# EAGLE schematic WaldoRevE (EAGLE 8.5.1)

## Sheet 1 of 4: Microcontroller Module
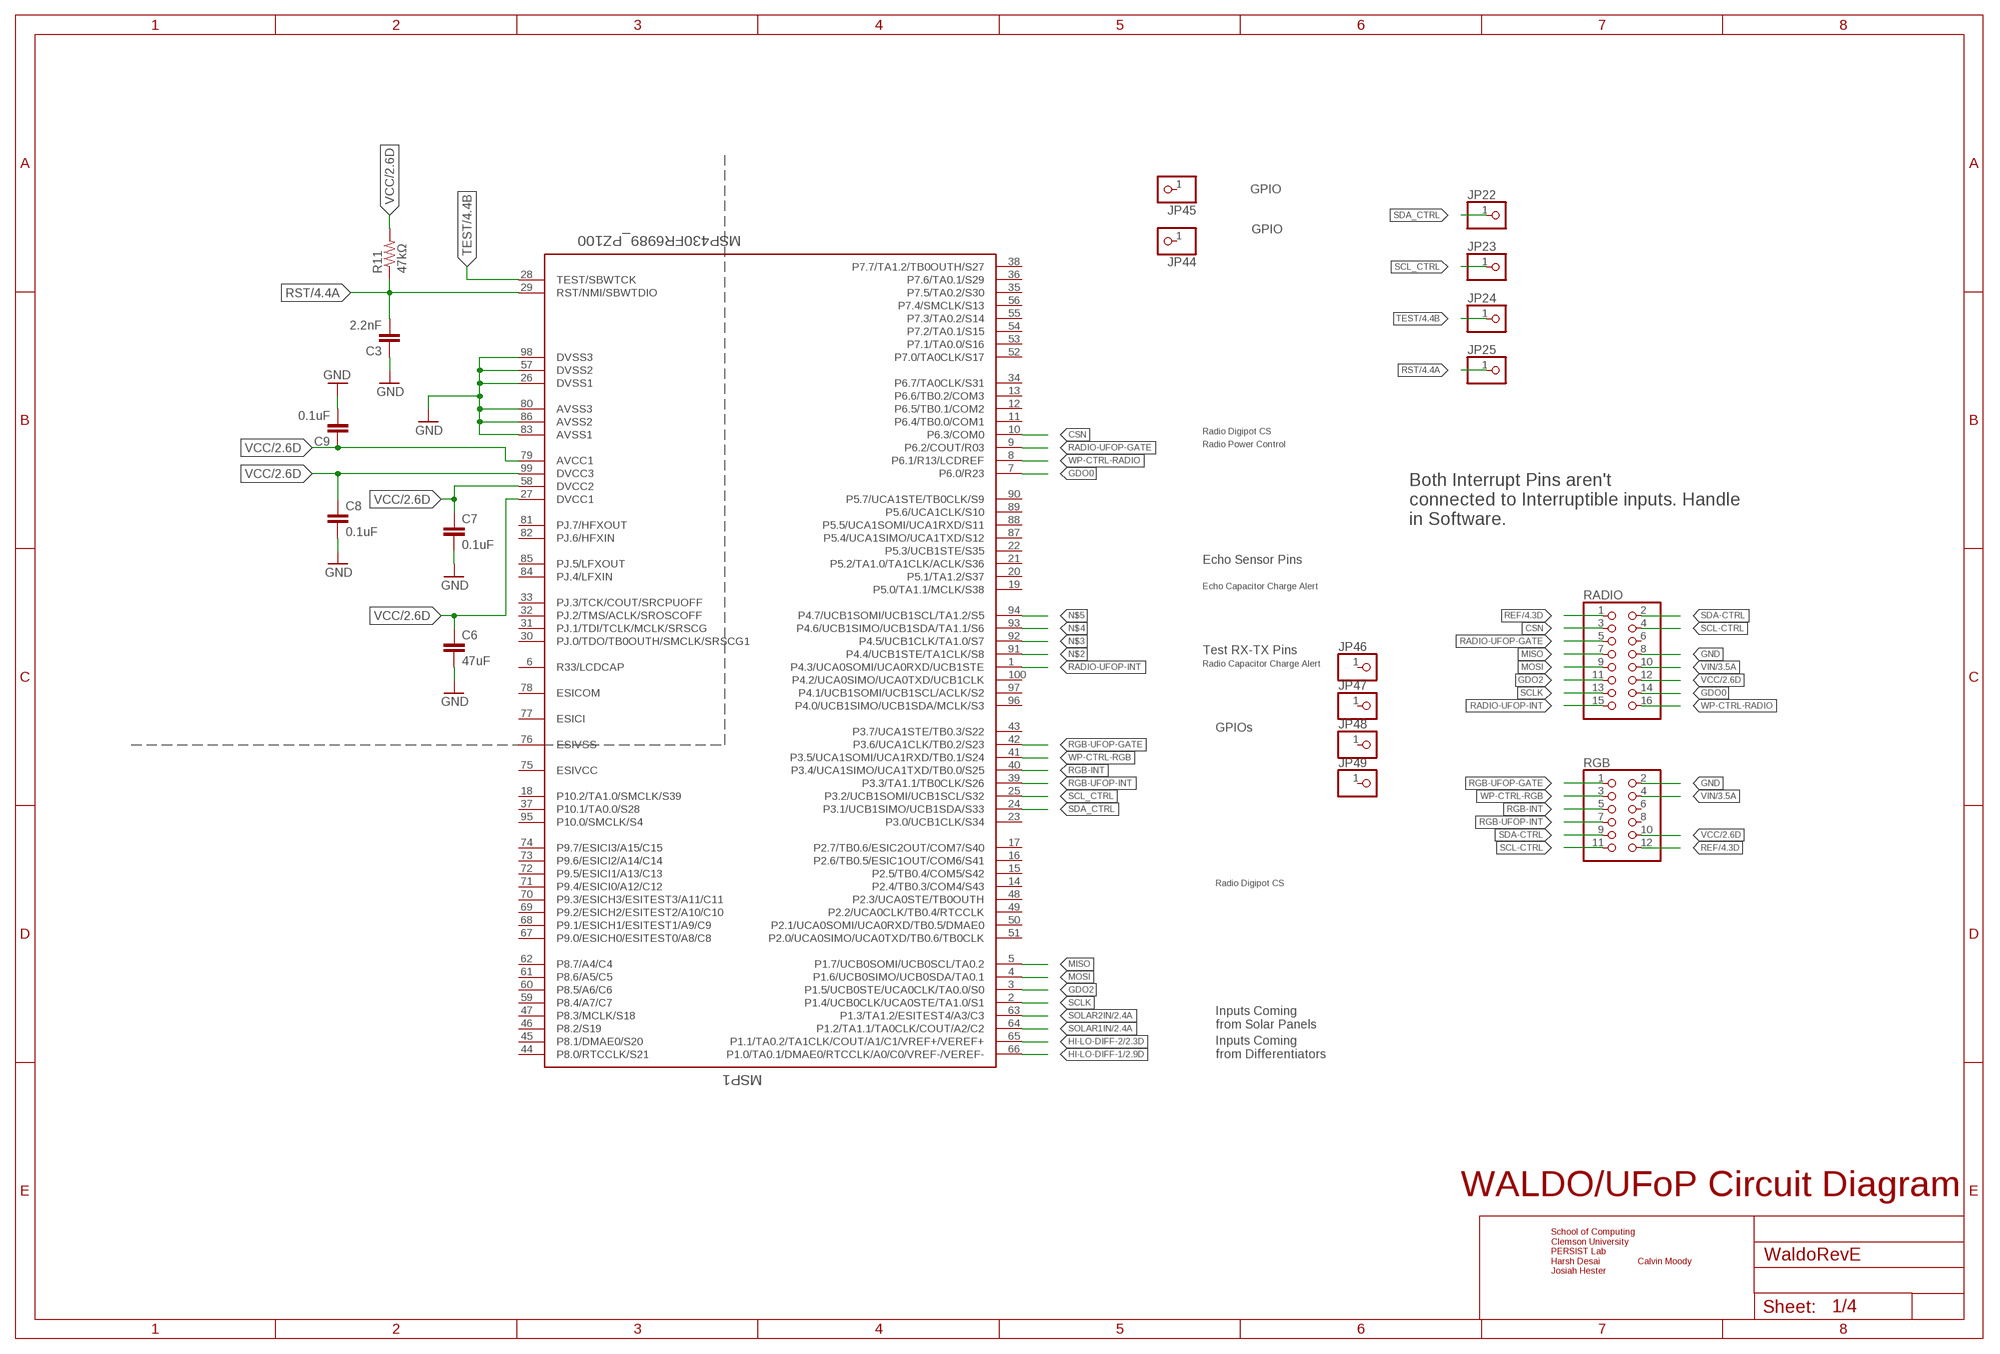
[diagram p0: schematic, sheet 1]

### Parts
C3  2.2nF  CAP0805  [0805]
C6  47uF  CAP0805  [0805]
C7  0.1uF  CAP0805  [0805]
C8  0.1uF  CAP0805  [0805]
C9  0.1uF  CAP0805  [0805]
JP22  PINHD-1X1  [1X01]
JP23  PINHD-1X1  [1X01]
JP24  PINHD-1X1  [1X01]
JP25  PINHD-1X1  [1X01]
JP44  PINHD-1X1  [1X01]
JP45  PINHD-1X1  [1X01]
JP46  PINHD-1X1  [1X01]
JP47  PINHD-1X1  [1X01]
JP48  PINHD-1X1  [1X01]
JP49  PINHD-1X1  [1X01]
MSP1  MSP430FR6989_PZ100  [PZ100]
R11  47kΩ  RESISTOR0805-RES  [0805]
RADIO  PINHD-2X8/90  [2X08/90]
RGB  PINHD-2X6/90  [2X06/90]

### Nets
CSN: MSP1.10(P6.3/COM0) RADIO.3
GDO0: MSP1.7(P6.0/R23) RADIO.14
GDO2: MSP1.3(P1.5/UCB0STE/UCA0CLK/TA0.0/S0) RADIO.11
GND: C3.1 C6.2 C7.2 C8.2 C9.2 MSP1.26(DVSS1) MSP1.57(DVSS2) MSP1.80(AVSS3) MSP1.83(AVSS1) MSP1.86(AVSS2) MSP1.98(DVSS3) RADIO.8 RGB.2 ; also sheet 2,3,4
HI-LO-DIFF-1: MSP1.66(P1.0/TA0.1/DMAE0/RTCCLK/A0/C0/VREF-/VEREF-) ; also sheet 2
HI-LO-DIFF-2: MSP1.65(P1.1/TA0.2/TA1CLK/COUT/A1/C1/VREF+/VEREF+) ; also sheet 2
MISO: MSP1.5(P1.7/UCB0SOMI/UCB0SCL/TA0.2) RADIO.7
MOSI: MSP1.4(P1.6/UCB0SIMO/UCB0SDA/TA0.1) RADIO.9
N$2: MSP1.91(P4.4/UCB1STE/TA1CLK/S8)
N$3: MSP1.92(P4.5/UCB1CLK/TA1.0/S7)
N$4: MSP1.93(P4.6/UCB1SIMO/UCB1SDA/TA1.1/S6)
N$5: MSP1.94(P4.7/UCB1SOMI/UCB1SCL/TA1.2/S5)
RADIO-UFOP-GATE: MSP1.9(P6.2/COUT/R03) RADIO.5
RADIO-UFOP-INT: MSP1.1(P4.3/UCA0SOMI/UCA0RXD/UCB1STE) RADIO.15
REF: RADIO.1 RGB.12 ; also sheet 4
RGB-INT: MSP1.40(P3.4/UCA1SIMO/UCA1TXD/TB0.0/S25) RGB.5
RGB-UFOP-GATE: MSP1.42(P3.6/UCA1CLK/TB0.2/S23) RGB.1
RGB-UFOP-INT: MSP1.39(P3.3/TA1.1/TB0CLK/S26) RGB.7
RST: C3.2 JP25.1 MSP1.29(RST/NMI/SBWTDIO) R11.1 ; also sheet 4
SCL-CTRL: RADIO.4 RGB.11
SCL_CTRL: JP23.1 MSP1.25(P3.2/UCB1SOMI/UCB1SCL/S32)
SCLK: MSP1.2(P1.4/UCB0CLK/UCA0STE/TA1.0/S1) RADIO.13
SDA-CTRL: RADIO.2 RGB.9
SDA_CTRL: JP22.1 MSP1.24(P3.1/UCB1SIMO/UCB1SDA/S33)
SOLAR1IN: MSP1.64(P1.2/TA1.1/TA0CLK/COUT/A2/C2) ; also sheet 2
SOLAR2IN: MSP1.63(P1.3/TA1.2/ESITEST4/A3/C3) ; also sheet 2
TEST: JP24.1 MSP1.28(TEST/SBWTCK) ; also sheet 4
VCC: C6.1 C7.1 C8.1 C9.1 MSP1.27(DVCC1) MSP1.58(DVCC2) MSP1.79(AVCC1) MSP1.99(DVCC3) R11.2 RADIO.12 RGB.10 ; also sheet 2,3,4
VIN: RADIO.10 RGB.4 ; also sheet 3,4
WP-CTRL-RADIO: MSP1.8(P6.1/R13/LCDREF) RADIO.16
WP-CTRL-RGB: MSP1.41(P3.5/UCA1SOMI/UCA1RXD/TB0.1/S24) RGB.3
Unconnected: JP44.1 JP45.1 JP46.1 JP47.1 JP48.1 JP49.1 MSP1.6(R33/LCDCAP) MSP1.11(P6.4/TB0.0/COM1) MSP1.12(P6.5/TB0.1/COM2) MSP1.13(P6.6/TB0.2/COM3) MSP1.14(P2.4/TB0.3/COM4/S43) MSP1.15(P2.5/TB0.4/COM5/S42) MSP1.16(P2.6/TB0.5/ESIC1OUT/COM6/S41) MSP1.17(P2.7/TB0.6/ESIC2OUT/COM7/S40) MSP1.18(P10.2/TA1.0/SMCLK/S39) MSP1.19(P5.0/TA1.1/MCLK/S38) MSP1.20(P5.1/TA1.2/S37) MSP1.21(P5.2/TA1.0/TA1CLK/ACLK/S36) MSP1.22(P5.3/UCB1STE/S35) MSP1.23(P3.0/UCB1CLK/S34) MSP1.30(PJ.0/TDO/TB0OUTH/SMCLK/SRSCG1) MSP1.31(PJ.1/TDI/TCLK/MCLK/SRSCG) MSP1.32(PJ.2/TMS/ACLK/SROSCOFF) MSP1.33(PJ.3/TCK/COUT/SRCPUOFF) MSP1.34(P6.7/TA0CLK/S31) MSP1.35(P7.5/TA0.2/S30) MSP1.36(P7.6/TA0.1/S29) MSP1.37(P10.1/TA0.0/S28) MSP1.38(P7.7/TA1.2/TB0OUTH/S27) MSP1.43(P3.7/UCA1STE/TB0.3/S22) MSP1.44(P8.0/RTCCLK/S21) MSP1.45(P8.1/DMAE0/S20) MSP1.46(P8.2/S19) MSP1.47(P8.3/MCLK/S18) MSP1.48(P2.3/UCA0STE/TB0OUTH) MSP1.49(P2.2/UCA0CLK/TB0.4/RTCCLK) MSP1.50(P2.1/UCA0SOMI/UCA0RXD/TB0.5/DMAE0) MSP1.51(P2.0/UCA0SIMO/UCA0TXD/TB0.6/TB0CLK) MSP1.52(P7.0/TA0CLK/S17) MSP1.53(P7.1/TA0.0/S16) MSP1.54(P7.2/TA0.1/S15) MSP1.55(P7.3/TA0.2/S14) MSP1.56(P7.4/SMCLK/S13) MSP1.59(P8.4/A7/C7) MSP1.60(P8.5/A6/C6) MSP1.61(P8.6/A5/C5) MSP1.62(P8.7/A4/C4) MSP1.67(P9.0/ESICH0/ESITEST0/A8/C8) MSP1.68(P9.1/ESICH1/ESITEST1/A9/C9) MSP1.69(P9.2/ESICH2/ESITEST2/A10/C10) MSP1.70(P9.3/ESICH3/ESITEST3/A11/C11) MSP1.71(P9.4/ESICI0/A12/C12) MSP1.72(P9.5/ESICI1/A13/C13) MSP1.73(P9.6/ESICI2/A14/C14) MSP1.74(P9.7/ESICI3/A15/C15) MSP1.75(ESIVCC) MSP1.76(ESIVSS) MSP1.77(ESICI) MSP1.78(ESICOM) MSP1.81(PJ.7/HFXOUT) MSP1.82(PJ.6/HFXIN) MSP1.84(PJ.4/LFXIN) MSP1.85(PJ.5/LFXOUT) MSP1.87(P5.4/UCA1SIMO/UCA1TXD/S12) MSP1.88(P5.5/UCA1SOMI/UCA1RXD/S11) MSP1.89(P5.6/UCA1CLK/S10) MSP1.90(P5.7/UCA1STE/TB0CLK/S9) MSP1.95(P10.0/SMCLK/S4) MSP1.96(P4.0/UCB1SIMO/UCB1SDA/MCLK/S3) MSP1.97(P4.1/UCB1SOMI/UCB1SCL/ACLK/S2) MSP1.100(P4.2/UCA0SIMO/UCA0TXD/UCB1CLK) RADIO.6 RGB.6 RGB.8

### Notes on the sheet
- GPIO
- GPIO
- Radio Digipot CS
- Radio Power Control
- Both Interrupt Pins aren't 
  connected to Interruptible inputs. Handle
  in Software.
- Echo Sensor Pins
- Echo Capacitor Charge Alert
- Test RX-TX Pins
- Radio Capacitor Charge Alert
- GPIOs
- Radio Digipot CS
- Inputs Coming 
  from Solar Panels
- Inputs Coming 
  from Differentiators
- WALDO/UFoP Circuit Diagram
- School of Computing
  Clemson University
  PERSIST Lab
  Harsh Desai               Calvin Moody
  Josiah Hester

## Sheet 2 of 4: Solar Panels + Processing (Differentiators)
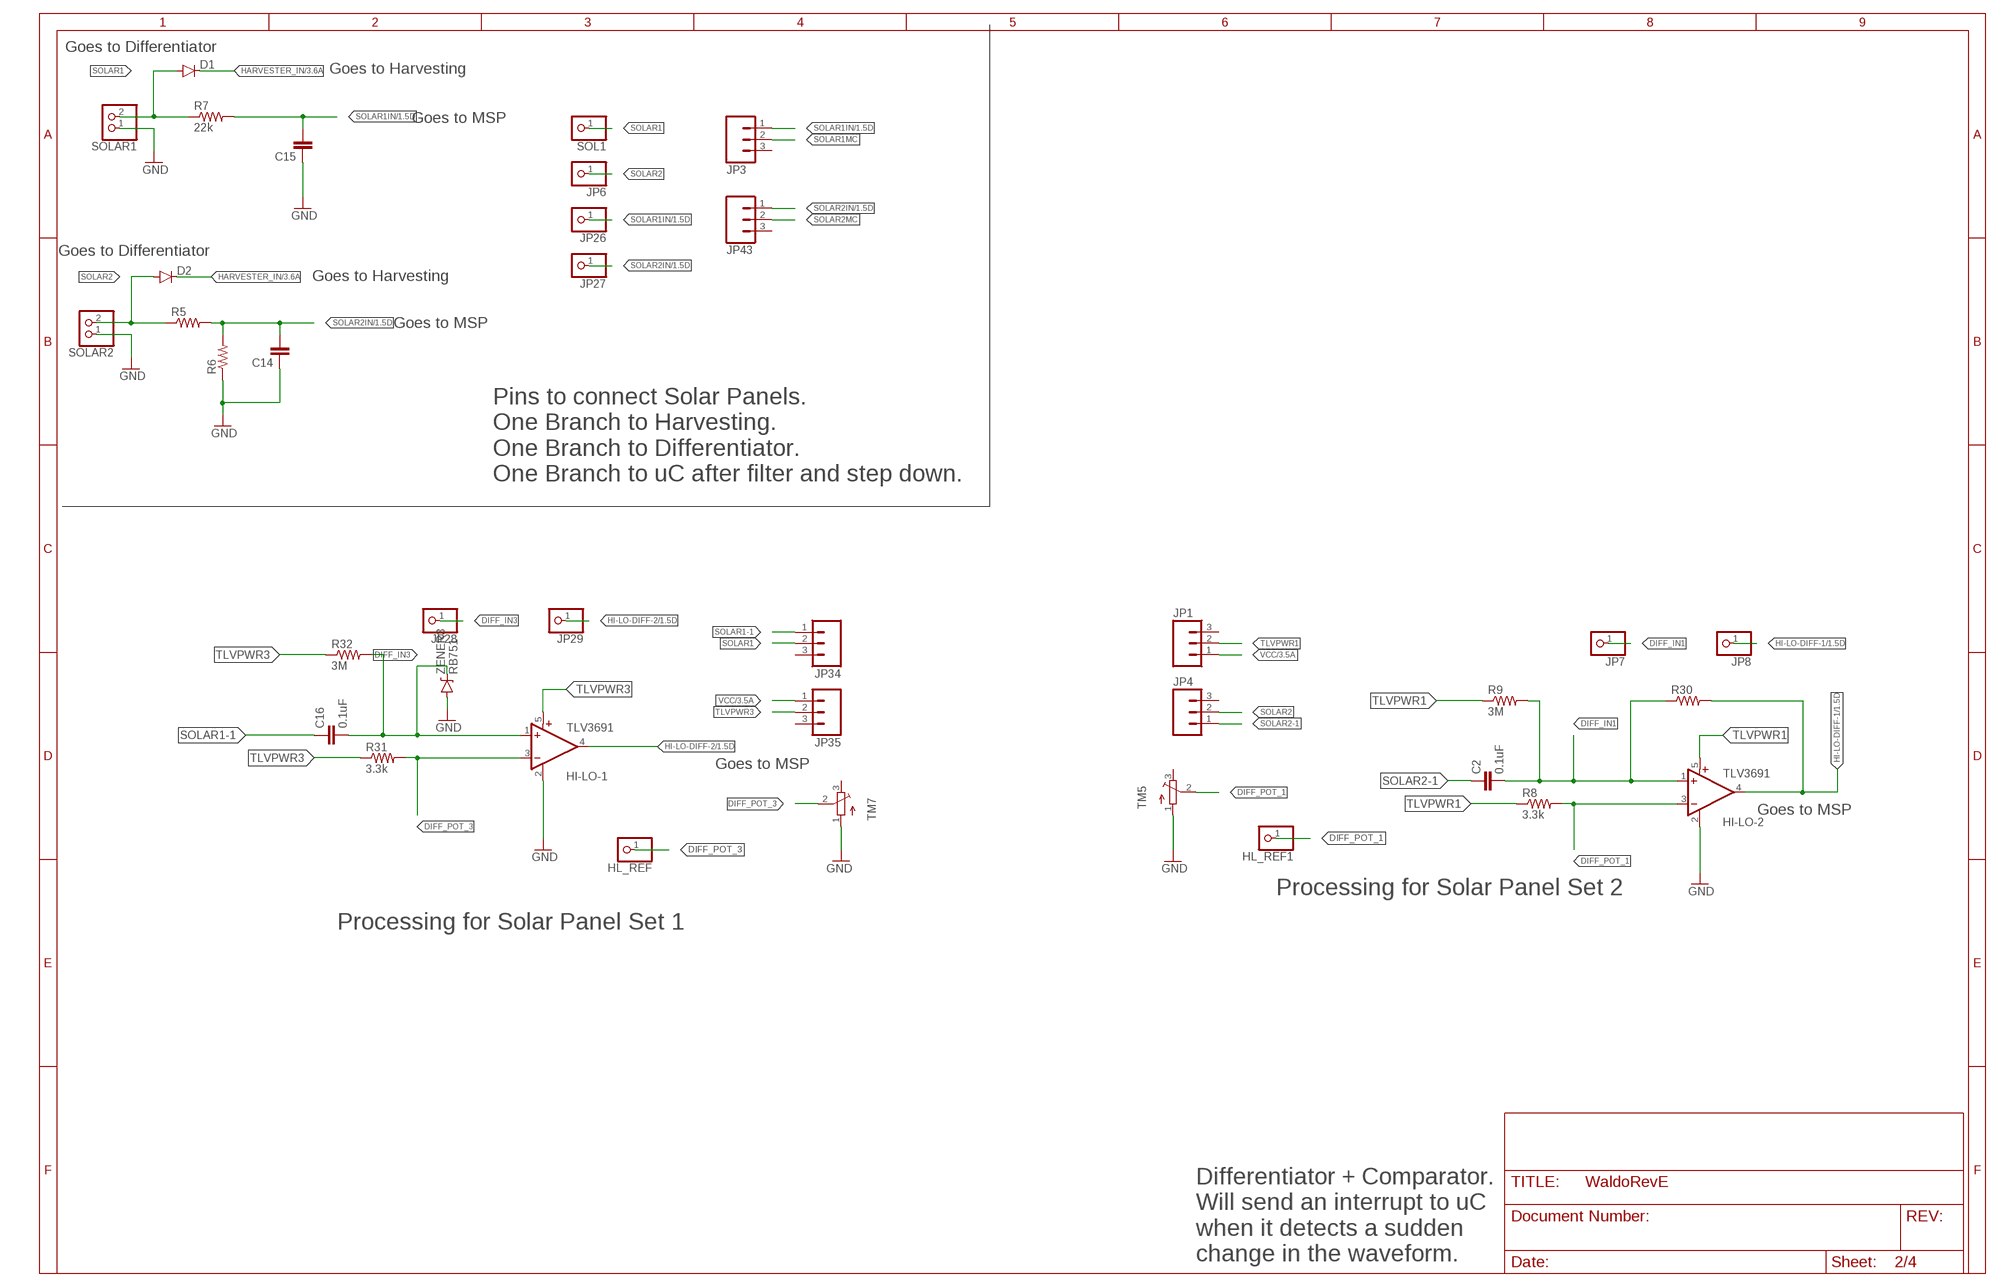
[diagram p1: schematic, sheet 2]

### Parts
C2  0.1uF  CAP0805  [0805]
C14  CAP0805  [0805]
C15  CAP0805  [0805]
C16  0.1uF  CAP0805  [0805]
D1  DIODESOD523  [SOD523]
D2  DIODESOD523  [SOD523]
HI-LO-1  TLV3691  [SC70-5]
HI-LO-2  TLV3691  [SC70-5]
HL_REF  PINHD-1X1  [1X01]
HL_REF1  PINHD-1X1  [1X01]
JP1  M03  [1X03-1.27MM]
JP3  M03  [1X03-1.27MM]
JP4  M03  [1X03-1.27MM]
JP6  PINHD-1X1  [1X01]
JP7  PINHD-1X1  [1X01]
JP8  PINHD-1X1  [1X01]
JP26  PINHD-1X1  [1X01]
JP27  PINHD-1X1  [1X01]
JP28  PINHD-1X1  [1X01]
JP29  PINHD-1X1  [1X01]
JP34  M03  [1X03-1.27MM]
JP35  M03  [1X03-1.27MM]
JP43  M03  [1X03-1.27MM]
R5  RESISTOR0805-RES  [0805]
R6  RESISTOR0805-RES  [0805]
R7  22k  RESISTOR0805-RES  [0805]
R8  3.3k  RESISTOR0805-RES  [0805]
R9  3M  RESISTOR0805-RES  [0805]
R30  RESISTOR0805-RES  [0805]
R31  3.3k  RESISTOR0805-RES  [0805]
R32  3M  RESISTOR0805-RES  [0805]
SOL1  PINHD-1X1  [1X01]
SOLAR1  PINHD-1X2  [1X02]
SOLAR2  PINHD-1X2  [1X02]
TM5  TRIMPOTTC33X  [TC33X]
TM7  TRIMPOTTC33X  [TC33X]
ZENER3  RB751  DIODE-ZENER  [SOD-523]

### Nets
DIFF_IN1: C2.2 HI-LO-2.1(+IN) JP7.1 R9.2 R30.1
DIFF_IN3: C16.2 HI-LO-1.1(+IN) JP28.1 R32.2 ZENER3.CATHODE(C)
DIFF_POT_1: HI-LO-2.3(-IN) HL_REF1.1 R8.2 TM5.2(S)
DIFF_POT_3: HI-LO-1.3(-IN) HL_REF.1 R31.2 TM7.2(S)
GND: C14.1 C15.1 HI-LO-1.2(GND) HI-LO-2.2(GND) R6.1 SOLAR1.1 SOLAR2.1 TM5.1(A) TM7.1(A) ZENER3.ANODE(A) ; also sheet 1,3,4
HARVESTER_IN: D1.C D2.C ; also sheet 3
HI-LO-DIFF-1: HI-LO-2.4(OUT) JP8.1 R30.2 ; also sheet 1
HI-LO-DIFF-2: HI-LO-1.4(OUT) JP29.1 ; also sheet 1
SOLAR1: D1.A JP34.2 R7.1 SOL1.1 SOLAR1.2
SOLAR1-1: C16.1 JP34.1
SOLAR1IN: C15.2 JP3.1 JP26.1 R7.2 ; also sheet 1
SOLAR1MC: JP3.2
SOLAR2: D2.A JP4.2 JP6.1 R5.1 SOLAR2.2
SOLAR2-1: C2.1 JP4.1
SOLAR2IN: C14.2 JP27.1 JP43.1 R5.2 R6.2 ; also sheet 1
SOLAR2MC: JP43.2
TLVPWR1: HI-LO-2.5(V+) JP1.2 R8.1 R9.1
TLVPWR3: HI-LO-1.5(V+) JP35.2 R31.1 R32.1
VCC: JP1.1 JP35.1 ; also sheet 1,3,4
Unconnected: JP1.3 JP3.3 JP4.3 JP34.3 JP35.3 JP43.3 TM5.3(E) TM7.3(E)

### Notes on the sheet
- Goes to Differentiator
- Goes to Harvesting
- Goes to MSP
- Goes to Differentiator
- Goes to Harvesting
- Goes to MSP
- Pins to connect Solar Panels.
  One Branch to Harvesting.
  One Branch to Differentiator.
  One Branch to uC after filter and step down.
- Goes to MSP
- Goes to MSP
- Processing for Solar Panel Set 2
- Processing for Solar Panel Set 1
- Differentiator + Comparator.
  Will send an interrupt to uC 
  when it detects a sudden 
  change in the waveform.

## Sheet 3 of 4: Battery + Regulator
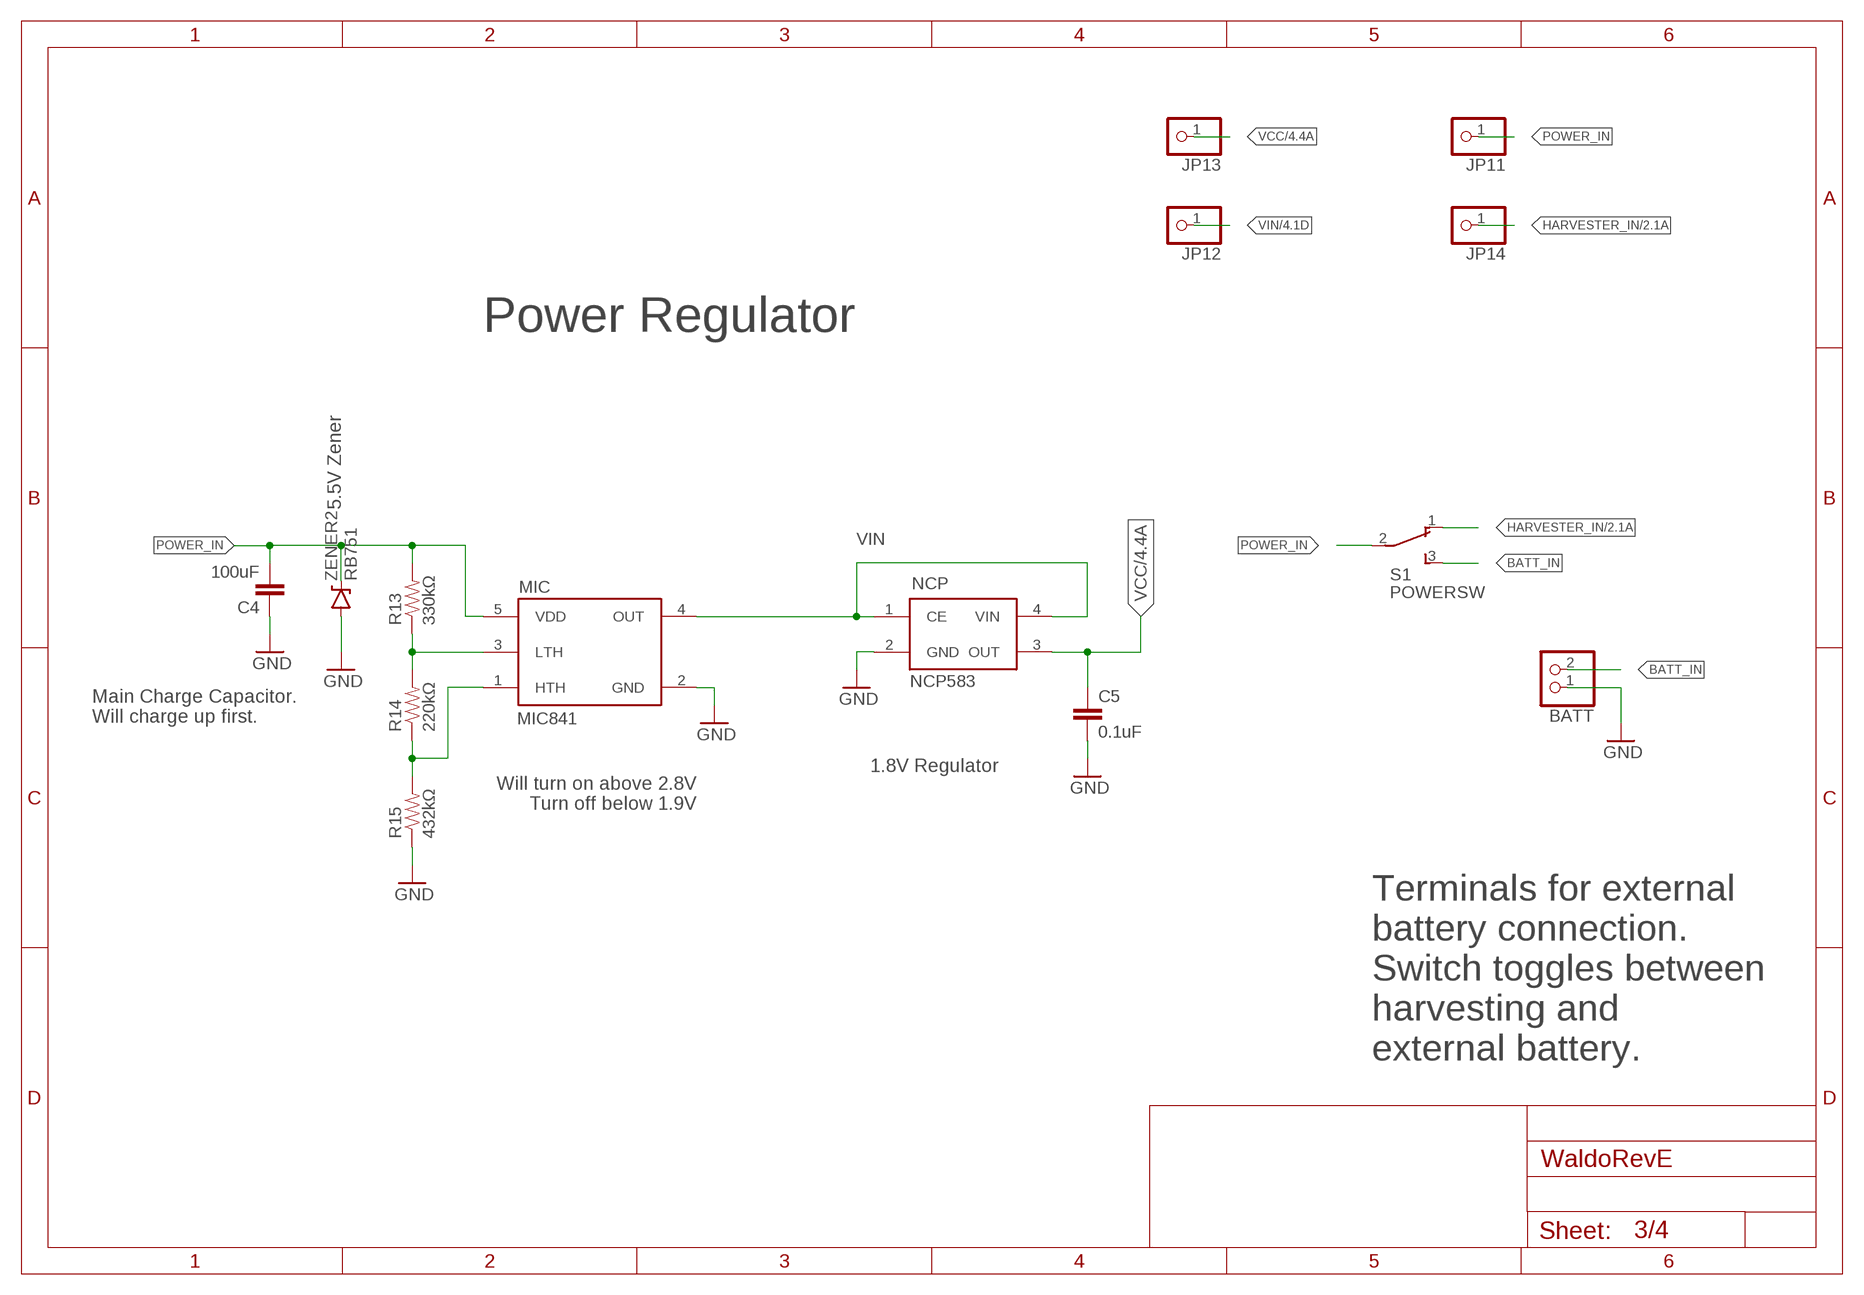
[diagram p2: schematic, sheet 3]

### Parts
BATT  PINHD-1X2  [1X02]
C4  100uF  CAP0805  [0805]
C5  0.1uF  CAP0805  [0805]
JP11  PINHD-1X1  [1X01]
JP12  PINHD-1X1  [1X01]
JP13  PINHD-1X1  [1X01]
JP14  PINHD-1X1  [1X01]
MIC  MIC841  [SC70-5]
NCP  NCP583  [SC82-AB_1PRIMARY]
R13  330kΩ  RESISTOR0805-RES  [0805]
R14  220kΩ  RESISTOR0805-RES  [0805]
R15  432kΩ  RESISTOR0805-RES  [0805]
S1  POWERSW  [TL3XYO]
ZENER2  RB751  DIODE-ZENER  [SOD-523]

### Nets
BATT_IN: BATT.2 S1.3(S)
GND: BATT.1 C4.1 C5.2 MIC.2(GND) NCP.2(GND) R15.1 ZENER2.ANODE(A) ; also sheet 1,2,4
HARVESTER_IN: JP14.1 S1.1(O) ; also sheet 2
N$11: MIC.3(LTH) R13.1 R14.2
N$12: MIC.1(HTH) R14.1 R15.2
POWER_IN: C4.2 JP11.1 MIC.5(VDD) R13.2 S1.2(P) ZENER2.CATHODE(C)
VCC: C5.1 JP13.1 NCP.3(OUT) ; also sheet 1,2,4
VIN: JP12.1 MIC.4(OUT) NCP.1(CE) NCP.4(VIN) ; also sheet 1,4

### Notes on the sheet
- Power Regulator
- 5.5V Zener
- Main Charge Capacitor.
  Will charge up first.
- 1.8V Regulator
- Will turn on above 2.8V
  Turn off below 1.9V
- Terminals for external
  battery connection.
  Switch toggles between
  harvesting and 
  external battery.

## Sheet 4 of 4: Programmer, RTC, Misc
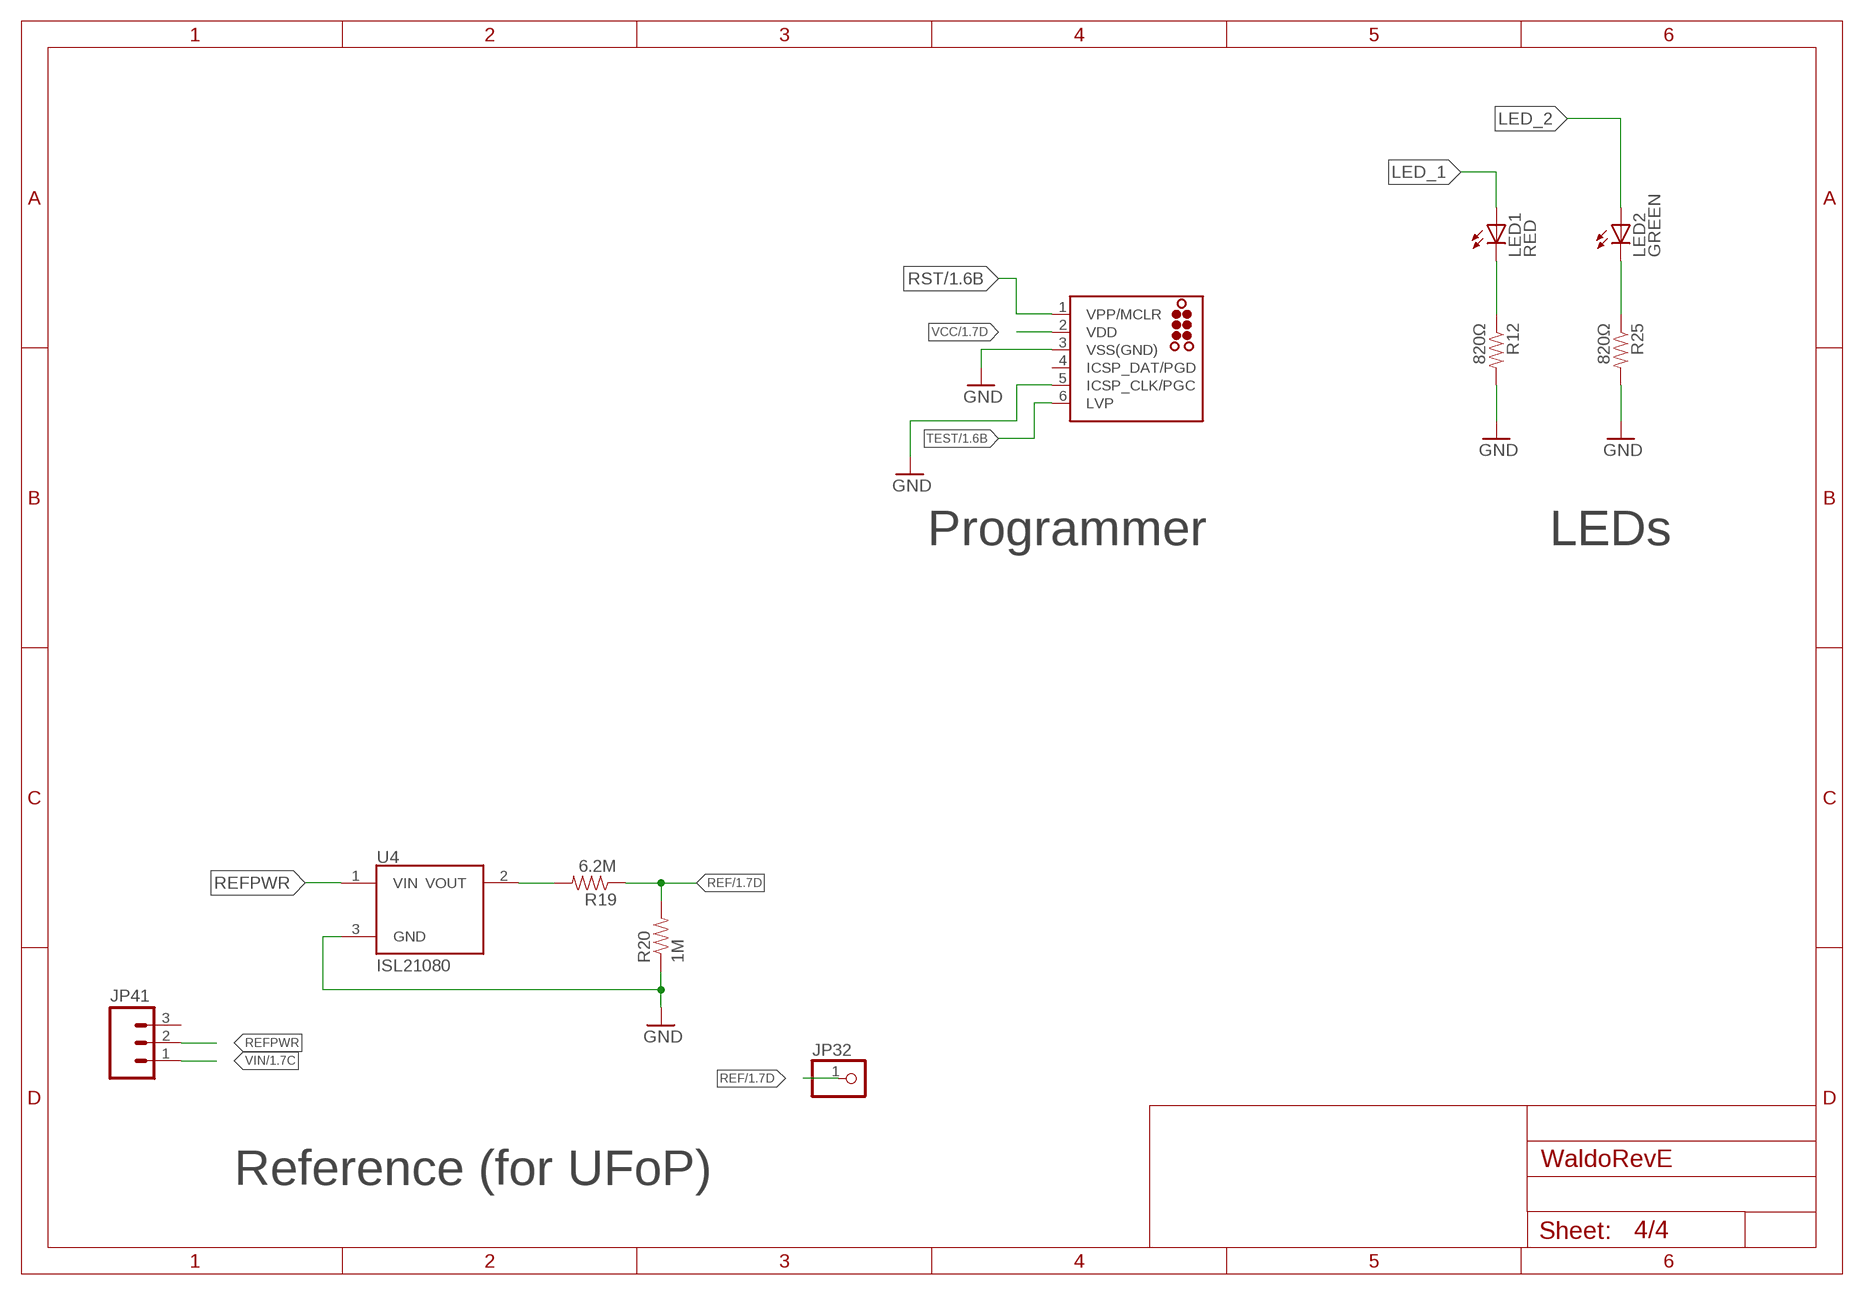
[diagram p3: schematic, sheet 4]

### Parts
J2  TC2030-MCP-NL  [TC2030-MCP-NL]
JP32  PINHD-1X1  [1X01]
JP41  M03  [1X03-1.27MM]
LED1  RED  LEDCHIP-LED0805  [CHIP-LED0805]
LED2  GREEN  LEDCHIP-LED0805  [CHIP-LED0805]
R12  820Ω  RESISTOR0805-RES  [0805]
R19  6.2M  RESISTOR0805-RES  [0805]
R20  1M  RESISTOR0805-RES  [0805]
R25  820Ω  RESISTOR0805-RES  [0805]
U4  ISL21080  [SOT-23]

### Nets
GND: J2.3(VSS(GND)) J2.5(ICSP_CLK/PGC) R12.2 R20.1 R25.2 U4.3(GND) ; also sheet 1,2,3
LED_1: LED1.A
LED_2: LED2.A
N$7: LED1.C R12.1
N$9: LED2.C R25.1
N$14: R19.2 U4.2(VOUT)
REF: JP32.1 R19.1 R20.2 ; also sheet 1
REFPWR: JP41.2 U4.1(VIN)
RST: J2.1(VPP/MCLR) ; also sheet 1
TEST: J2.6(LVP) ; also sheet 1
VCC: J2.2(VDD) ; also sheet 1,2,3
VIN: JP41.1 ; also sheet 1,3
Unconnected: J2.4(ICSP_DAT/PGD) JP41.3

### Notes on the sheet
- Programmer | LEDs
- Reference (for UFoP)

## Library data of the parts
BATT SOLAR1 SOLAR2 = pinhead:PINHD-1X2: PIN HEADER
C2-C9 C14-C16 = SparkFun-Capacitors:CAP: Capacitor Standard 0603 ceramic capacitor, and 0.1" leaded capacitor.
D1 D2 = SparkFun-DiscreteSemi:DIODE: Diode These are standard reverse protection diodes and small signal diodes. SMA package can handle up to about 1A. SOD-323 can handle about 200mA. What the SOD-323 package when ordering, there are some mfgs out there that are 5-pin packages.
HI-LO-1 HI-LO-2 = fedpower:TLV3691: 0.9-V to 6.5-V, Nanopower Comparator Datasheets Analog Signal Chain Guide <http://www.ti.com/lit/pdf/slyb174> TLV3691 <http://www.ti.com/lit/ds/symlink/tlv3691.pdf> Manufacturer Product Page TLV3691IDPFR Specifications <http://www.ti.com/general/docs/suppproductinfo.tsp?distId=10&orderablePartNumber=TLV3691IDPFR> Standard Package <javascript:dlgHelp('Standard%20Packaging%20Help');> 1 Category Integrated Circuits (ICs) </product-search/en/integrated-circuits-ics> Family Linear - Comparators </product-search/en/integrated-circuits-ics/linear-comparators/2556221> Series - Packaging <javascript:dlgHelp('Standard%20Packaging%20Help');> Cut Tape (CT) <javascript:dlgHelp('Cut%20Tape%20Help');> Type General Purpose Number of Elements 1 Output Type Push-Pull Voltage - Supply, Single/Dual (±) 0.9 V ~ 6.5 V, ±0.45 V ~ 3.25 V Voltage - Input Offset (Max) 3mV Current - Input Bias (Max) 100pA Current - Output (Typ) 42mA Current - Quiescent (Max) 150nA CMRR, PSRR (Typ) - Propagation Delay (Max) 35µs Hysteresis - Operating Temperature -40°C ~ 125°C Package / Case 6-XFDFN Mounting Type Surface Mount Supplier Device Package 6-X2SON (1x1) Online Catalog Comparators - 1 element </catalog/en/partgroup/comparators-1-element/3112?mpart=TLV3691IDPFR&vendor=296&WT.z_ref_page_type=PS&WT.z_ref_page_sub_type=PD&WT.z_ref_page_id=PD&WT.z_ref_page_event=DC_Link_Table> Other Names 296-37242-1
HL_REF HL_REF1 JP6-JP8 JP11-JP14 JP22-JP29 JP32 JP44-JP49 SOL1 = adafruit:PINHD-1X1: Pin header 1x1 for 0.1" spacing With round pins
J2 = tag-connect_msp430:TC2030: TAG-CONNECT ICSP Connector Manufacturer: Tag-Connect <http://www.tag-connect.com> Cable for easy In-Circuit Serial Programming. Designed for Microchip ICD2, suitable for many others. Two variants - one "with legs" (for hands-free fit on PCB) and another "without legs" for quick programming. PAD Description 1 MCLR/Vpp 2 Vdd 3 GND 4 PGD (ISPDAT) 5 PGC (ISPCLK) 6 nc (used for LVP) ©2009 ROFA.cz - modified and updated by Robert Darlington ‹rdarlington@gmail.com›
JP1 JP3 JP4 JP34 JP35 JP41 JP43 = SparkFun-Connectors:M03: Header 3 Standard 3-pin 0.1" header. Use with straight break away headers (SKU : PRT-00116), right angle break away headers (PRT-00553), swiss pins (PRT-00743), machine pins (PRT-00117), and female headers (PRT-00115). Molex polarized connector foot print use with SKU : PRT-08232 with associated crimp pins and housings.
LED1 LED2 = led:LED: LED OSRAM: - CHIPLED LG R971, LG N971, LY N971, LG Q971, LY Q971, LO R971, LY R971 LH N974, LH R974 LS Q976, LO Q976, LY Q976 LO Q996 - Hyper CHIPLED LW Q18S LB Q993, LB Q99A, LB R99A - SideLED LS A670, LO A670, LY A670, LG A670, LP A670 LB A673, LV A673, LT A673, LW A673 LH A674 LY A675 LS A676, LA A676, LO A676, LY A676, LW A676 LS A679, LY A679, LG A679 - Hyper Micro SIDELED® LS Y876, LA Y876, LO Y876, LY Y876 LT Y87S - SmartLED LW L88C, LW L88S LB L89C, LB L89S, LG L890 LS L89K, LO L89K, LY L89K LS L896, LA L896, LO L896, LY L896 - TOPLED LS T670, LO T670, LY T670, LG T670, LP T670 LSG T670, LSP T670, LSY T670, LOP T670, LYG T670 LG T671, LOG T671, LSG T671 LB T673, LV T673, LT T673, LW T673 LH T674 LS T676, LA T676, LO T676, LY T676, LB T676, LH T676, LSB T676, LW T676 LB T67C, LV T67C, LT T67C, LS T67K, LO T67K, LY T67K, LW E67C LS E67B, LA E67B, LO E67B, LY E67B, LB E67C, LV E67C, LT E67C LW T67C LS T679, LY T679, LG T679 LS T770, LO T770, LY T770, LG T770, LP T770 LB T773, LV T773, LT T773, LW T773 LH T774 LS E675, LA E675, LY E675, LS T675 LS T776, LA T776, LO T776, LY T776, LB T776 LHGB T686 LT T68C, LB T68C - Hyper Mini TOPLED® LB M676 - Mini TOPLED Santana® LG M470 LS M47K, LO M47K, LY M47K Source: http://www.osram.convergy.de LUXEON: - LUMILED® LXK2-PW12-R00, LXK2-PW12-S00, LXK2-PW14-U00, LXK2-PW14-V00 LXK2-PM12-R00, LXK2-PM12-S00, LXK2-PM14-U00 LXK2-PE12-Q00, LXK2-PE12-R00, LXK2-PE12-S00, LXK2-PE14-T00, LXK2-PE14-U00 LXK2-PB12-K00, LXK2-PB12-L00, LXK2-PB12-M00, LXK2-PB14-N00, LXK2-PB14-P00, LXK2-PB14-Q00 LXK2-PR12-L00, LXK2-PR12-M00, LXK2-PR14-Q00, LXK2-PR14-R00 LXK2-PD12-Q00, LXK2-PD12-R00, LXK2-PD12-S00 LXK2-PH12-R00, LXK2-PH12-S00 LXK2-PL12-P00, LXK2-PL12-Q00, LXK2-PL12-R00 Source: www.luxeon.com KINGBRIGHT: KA-3528ASYC Source: www.kingbright.com
MIC = mic841:MIC841: MIC841:Comparator with reference and adj. hysteresis
MSP1 = msp430:MSP430FR6989_PZ100
NCP = ncp583:NCP583: NCP583 - Ultra-Low Iq 150 mA CMOS LDO Regulator with Enable The NCP583 series of low dropout regulators are designed for portable battery powered applications which require precise output voltage accuracy and low quiescent current. These devices feature an enable function which lowers current consumption significantly and are offered in two small packages; SC−82AB and the SOT−563. A 1.0 mF ceramic capacitor is the recommended value to be used with these devices on the output pin.
R5-R9 R11-R15 R25 R30-R32 = SparkFun-Resistors:RESISTOR: Resistor Basic schematic elements and footprints for 0603, 1206, and PTH resistors.
R19 = SparkFun-Resistors:RESISTOR: Resistor Basic schematic elements and footprints for 0603, 1206, and PTH resistors.; DIGIKEY: 541-6.20MHCT-ND
R20 = SparkFun-Resistors:RESISTOR: Resistor Basic schematic elements and footprints for 0603, 1206, and PTH resistors.; DIGIKEY: 311-1.00MHRCT-ND
RADIO = pinhead:PINHD-2X8: PIN HEADER
RGB = pinhead:PINHD-2X6: PIN HEADER
S1 = GreenBoard:POWERSW: TINY SWITCH ON - ON Source: http://www2.produktinfo.conrad.com/datenblaetter/700000-724999/705152-da-01-de-Subminiaturschalter_TL_36YO.pdf
TM5 TM7 = adafruit:TRIMPOT: SMT trimmer potentiometer part number TC33X http://www.ladyada.net/library/eagle
U4 = isl21080:ISL21080: Intersil: ISL21080, 300nA NanoPower Voltage References The ISL21080 analog voltage references feature low supply voltage operation at ultra-low 310nA typ, 1.5µA max operating current. Additionally, the ISL21080 family features guaranteed initial accuracy as low as ±0.2% and 50ppm/°C temperature coefficient. These references are ideal for general purpose portable applications to extend battery life at lower cost. The ISL21080 is provided in the industry standard 3 Ld SOT-23 pinout. The ISL21080 output voltages can be used as precision voltage sources for voltage monitors, control loops, standby voltages for low power states for DSP, FPGA, Datapath Controllers, microcontrollers and other core voltages: 0.9V, 1.024V, 1.25V, 1.5V, 2.048V, 2.5V, 3.0V, 3.3V, 4.096V and 5.0V. Special Note: Post-assembly x-ray inspection may lead to permanent changes in device output voltage and should be minimized or avoided. For further information, please see “Applications Information” on page 14 and AN1533, “X-Ray Effects on Intersil FGA References”.; DIGIKEY: ISL21080DIH309Z-TKCT-ND
ZENER2 ZENER3 = Parts:DIODE-ZENER: Zener Diode Production Part - 8199 3.4V Zener Voltage